# Vivado block design finn_design, xczu7ev-ffvc1156-2-e, Vivado 2022.2
create_bd_design finn_design

create_bd_intf_port -mode Slave -vlnv xilinx.com:interface:axis_rtl:1.0 s_axis_0
set_property -dict [list \
  CONFIG.HAS_TKEEP 0 \
  CONFIG.HAS_TLAST 0 \
  CONFIG.HAS_TREADY 1 \
  CONFIG.HAS_TSTRB 0 \
  CONFIG.LAYERED_METADATA undef \
  CONFIG.TDATA_NUM_BYTES 3 \
  CONFIG.TDEST_WIDTH 0 \
  CONFIG.TID_WIDTH 0 \
  CONFIG.TUSER_WIDTH 0 \
] [get_bd_intf_ports s_axis_0]
create_bd_intf_port -mode Master -vlnv xilinx.com:interface:axis_rtl:1.0 m_axis_0
create_bd_port -dir I -type clk ap_clk
set_property -dict {CONFIG.FREQ_HZ 100000000} [get_bd_ports ap_clk]
create_bd_port -dir I -type rst ap_rst_n

create_bd_cell -type module -reference StreamingFIFO_rtl_0 StreamingFIFO_rtl_0
create_bd_cell -type module -reference FMPadding_rtl_0 FMPadding_rtl_0
create_bd_cell -type module -reference StreamingFIFO_rtl_1 StreamingFIFO_rtl_1
create_bd_cell -type module -reference StreamingDataWidthConverter_rtl_0 StreamingDataWidthConverter_rtl_0
create_bd_cell -type module -reference StreamingFIFO_rtl_2 StreamingFIFO_rtl_2
create_bd_cell -type module -reference ConvolutionInputGenerator_rtl_0 ConvolutionInputGenerator_rtl_0
create_bd_cell -type module -reference StreamingFIFO_rtl_3 StreamingFIFO_rtl_3
create_bd_cell -type module -reference StreamingDataWidthConverter_rtl_1 StreamingDataWidthConverter_rtl_1
create_bd_cell -type module -reference StreamingFIFO_rtl_4 StreamingFIFO_rtl_4
create_bd_cell -type hier MVAU_hls_0
create_bd_cell -type module -reference StreamingFIFO_rtl_5 StreamingFIFO_rtl_5
create_bd_cell -type ip -vlnv xilinx.com:hls:DuplicateStreams_hls_0:1.0 DuplicateStreams_hls_0
create_bd_cell -type module -reference StreamingFIFO_rtl_6 StreamingFIFO_rtl_6
create_bd_cell -type hier StreamingFIFO_rtl_7_0
create_bd_cell -type hier StreamingFIFO_rtl_7_1
create_bd_cell -type module -reference StreamingDataWidthConverter_rtl_2 StreamingDataWidthConverter_rtl_2
create_bd_cell -type module -reference StreamingFIFO_rtl_7_2 StreamingFIFO_rtl_7_2
create_bd_cell -type module -reference StreamingFIFO_rtl_8 StreamingFIFO_rtl_8
create_bd_cell -type module -reference StreamingFIFO_rtl_7_3 StreamingFIFO_rtl_7_3
create_bd_cell -type module -reference FMPadding_rtl_1 FMPadding_rtl_1
create_bd_cell -type module -reference Thresholding_rtl_0_axi_wrapper Thresholding_rtl_0
create_bd_cell -type module -reference StreamingFIFO_rtl_10 StreamingFIFO_rtl_10
create_bd_cell -type hier StreamingFIFO_rtl_9_0
create_bd_cell -type module -reference StreamingDataWidthConverter_rtl_3 StreamingDataWidthConverter_rtl_3
create_bd_cell -type hier StreamingFIFO_rtl_9_1
create_bd_cell -type module -reference StreamingFIFO_rtl_11 StreamingFIFO_rtl_11
create_bd_cell -type hier StreamingFIFO_rtl_9_2
create_bd_cell -type module -reference ConvolutionInputGenerator_rtl_1 ConvolutionInputGenerator_rtl_1
create_bd_cell -type module -reference StreamingFIFO_rtl_9_3 StreamingFIFO_rtl_9_3
create_bd_cell -type module -reference StreamingFIFO_rtl_12 StreamingFIFO_rtl_12
create_bd_cell -type module -reference StreamingFIFO_rtl_9_4 StreamingFIFO_rtl_9_4
create_bd_cell -type module -reference StreamingDataWidthConverter_rtl_4 StreamingDataWidthConverter_rtl_4
create_bd_cell -type module -reference StreamingFIFO_rtl_13 StreamingFIFO_rtl_13
create_bd_cell -type hier MVAU_hls_1
create_bd_cell -type module -reference StreamingFIFO_rtl_14 StreamingFIFO_rtl_14
create_bd_cell -type module -reference StreamingDataWidthConverter_rtl_5 StreamingDataWidthConverter_rtl_5
create_bd_cell -type module -reference StreamingFIFO_rtl_15 StreamingFIFO_rtl_15
create_bd_cell -type module -reference FMPadding_rtl_2 FMPadding_rtl_2
create_bd_cell -type module -reference StreamingFIFO_rtl_16 StreamingFIFO_rtl_16
create_bd_cell -type module -reference StreamingDataWidthConverter_rtl_6 StreamingDataWidthConverter_rtl_6
create_bd_cell -type module -reference StreamingFIFO_rtl_17 StreamingFIFO_rtl_17
create_bd_cell -type module -reference ConvolutionInputGenerator_rtl_2 ConvolutionInputGenerator_rtl_2
create_bd_cell -type module -reference StreamingFIFO_rtl_18 StreamingFIFO_rtl_18
create_bd_cell -type module -reference StreamingDataWidthConverter_rtl_7 StreamingDataWidthConverter_rtl_7
create_bd_cell -type module -reference StreamingFIFO_rtl_19 StreamingFIFO_rtl_19
create_bd_cell -type hier MVAU_hls_2
create_bd_cell -type module -reference StreamingFIFO_rtl_20 StreamingFIFO_rtl_20
create_bd_cell -type module -reference Thresholding_rtl_1_axi_wrapper Thresholding_rtl_1
create_bd_cell -type module -reference StreamingFIFO_rtl_21 StreamingFIFO_rtl_21
create_bd_cell -type ip -vlnv xilinx.com:hls:AddStreams_hls_0:1.0 AddStreams_hls_0
create_bd_cell -type module -reference StreamingFIFO_rtl_22 StreamingFIFO_rtl_22
create_bd_cell -type ip -vlnv xilinx.com:hls:DuplicateStreams_hls_1:1.0 DuplicateStreams_hls_1
create_bd_cell -type module -reference StreamingFIFO_rtl_23 StreamingFIFO_rtl_23
create_bd_cell -type hier StreamingFIFO_rtl_24_0
create_bd_cell -type hier StreamingFIFO_rtl_24_1
create_bd_cell -type module -reference StreamingDataWidthConverter_rtl_8 StreamingDataWidthConverter_rtl_8
create_bd_cell -type module -reference StreamingFIFO_rtl_24_2 StreamingFIFO_rtl_24_2
create_bd_cell -type module -reference StreamingFIFO_rtl_25 StreamingFIFO_rtl_25
create_bd_cell -type module -reference StreamingFIFO_rtl_24_3 StreamingFIFO_rtl_24_3
create_bd_cell -type module -reference FMPadding_rtl_3 FMPadding_rtl_3
create_bd_cell -type module -reference Thresholding_rtl_2_axi_wrapper Thresholding_rtl_2
create_bd_cell -type module -reference StreamingFIFO_rtl_27 StreamingFIFO_rtl_27
create_bd_cell -type hier StreamingFIFO_rtl_26_0
create_bd_cell -type module -reference StreamingDataWidthConverter_rtl_9 StreamingDataWidthConverter_rtl_9
create_bd_cell -type hier StreamingFIFO_rtl_26_1
create_bd_cell -type module -reference StreamingFIFO_rtl_28 StreamingFIFO_rtl_28
create_bd_cell -type hier StreamingFIFO_rtl_26_2
create_bd_cell -type module -reference ConvolutionInputGenerator_rtl_3 ConvolutionInputGenerator_rtl_3
create_bd_cell -type module -reference StreamingFIFO_rtl_26_3 StreamingFIFO_rtl_26_3
create_bd_cell -type module -reference StreamingFIFO_rtl_29 StreamingFIFO_rtl_29
create_bd_cell -type module -reference StreamingFIFO_rtl_26_4 StreamingFIFO_rtl_26_4
create_bd_cell -type module -reference StreamingDataWidthConverter_rtl_10 StreamingDataWidthConverter_rtl_10
create_bd_cell -type module -reference StreamingFIFO_rtl_30 StreamingFIFO_rtl_30
create_bd_cell -type hier MVAU_hls_3
create_bd_cell -type module -reference StreamingFIFO_rtl_31 StreamingFIFO_rtl_31
create_bd_cell -type module -reference StreamingDataWidthConverter_rtl_11 StreamingDataWidthConverter_rtl_11
create_bd_cell -type module -reference StreamingFIFO_rtl_32 StreamingFIFO_rtl_32
create_bd_cell -type module -reference FMPadding_rtl_4 FMPadding_rtl_4
create_bd_cell -type module -reference StreamingFIFO_rtl_33 StreamingFIFO_rtl_33
create_bd_cell -type module -reference StreamingDataWidthConverter_rtl_12 StreamingDataWidthConverter_rtl_12
create_bd_cell -type module -reference StreamingFIFO_rtl_34 StreamingFIFO_rtl_34
create_bd_cell -type module -reference ConvolutionInputGenerator_rtl_4 ConvolutionInputGenerator_rtl_4
create_bd_cell -type module -reference StreamingFIFO_rtl_35 StreamingFIFO_rtl_35
create_bd_cell -type module -reference StreamingDataWidthConverter_rtl_13 StreamingDataWidthConverter_rtl_13
create_bd_cell -type module -reference StreamingFIFO_rtl_36 StreamingFIFO_rtl_36
create_bd_cell -type hier MVAU_hls_4
create_bd_cell -type module -reference StreamingFIFO_rtl_37 StreamingFIFO_rtl_37
create_bd_cell -type module -reference Thresholding_rtl_3_axi_wrapper Thresholding_rtl_3
create_bd_cell -type module -reference StreamingFIFO_rtl_38 StreamingFIFO_rtl_38
create_bd_cell -type ip -vlnv xilinx.com:hls:AddStreams_hls_1:1.0 AddStreams_hls_1
create_bd_cell -type module -reference StreamingFIFO_rtl_39 StreamingFIFO_rtl_39
create_bd_cell -type ip -vlnv xilinx.com:hls:DuplicateStreams_hls_2:1.0 DuplicateStreams_hls_2
create_bd_cell -type module -reference StreamingFIFO_rtl_40 StreamingFIFO_rtl_40
create_bd_cell -type hier StreamingFIFO_rtl_41_0
create_bd_cell -type hier StreamingFIFO_rtl_41_1
create_bd_cell -type module -reference StreamingDataWidthConverter_rtl_14 StreamingDataWidthConverter_rtl_14
create_bd_cell -type hier StreamingFIFO_rtl_41_2
create_bd_cell -type module -reference StreamingFIFO_rtl_42 StreamingFIFO_rtl_42
create_bd_cell -type module -reference StreamingFIFO_rtl_41_3 StreamingFIFO_rtl_41_3
create_bd_cell -type module -reference FMPadding_rtl_5 FMPadding_rtl_5
create_bd_cell -type module -reference Thresholding_rtl_4_axi_wrapper Thresholding_rtl_4
create_bd_cell -type module -reference StreamingFIFO_rtl_44 StreamingFIFO_rtl_44
create_bd_cell -type hier StreamingFIFO_rtl_43_0
create_bd_cell -type module -reference StreamingDataWidthConverter_rtl_15 StreamingDataWidthConverter_rtl_15
create_bd_cell -type hier StreamingFIFO_rtl_43_1
create_bd_cell -type module -reference StreamingFIFO_rtl_45 StreamingFIFO_rtl_45
create_bd_cell -type hier StreamingFIFO_rtl_43_2
create_bd_cell -type module -reference ConvolutionInputGenerator_rtl_5 ConvolutionInputGenerator_rtl_5
create_bd_cell -type module -reference StreamingFIFO_rtl_43_3 StreamingFIFO_rtl_43_3
create_bd_cell -type module -reference StreamingFIFO_rtl_46 StreamingFIFO_rtl_46
create_bd_cell -type module -reference StreamingFIFO_rtl_43_4 StreamingFIFO_rtl_43_4
create_bd_cell -type module -reference StreamingDataWidthConverter_rtl_16 StreamingDataWidthConverter_rtl_16
create_bd_cell -type module -reference StreamingFIFO_rtl_47 StreamingFIFO_rtl_47
create_bd_cell -type hier MVAU_hls_5
create_bd_cell -type module -reference StreamingFIFO_rtl_48 StreamingFIFO_rtl_48
create_bd_cell -type module -reference StreamingDataWidthConverter_rtl_17 StreamingDataWidthConverter_rtl_17
create_bd_cell -type module -reference StreamingFIFO_rtl_49 StreamingFIFO_rtl_49
create_bd_cell -type module -reference FMPadding_rtl_6 FMPadding_rtl_6
create_bd_cell -type module -reference StreamingFIFO_rtl_50 StreamingFIFO_rtl_50
create_bd_cell -type module -reference StreamingDataWidthConverter_rtl_18 StreamingDataWidthConverter_rtl_18
create_bd_cell -type module -reference StreamingFIFO_rtl_51 StreamingFIFO_rtl_51
create_bd_cell -type module -reference ConvolutionInputGenerator_rtl_6 ConvolutionInputGenerator_rtl_6
create_bd_cell -type module -reference StreamingFIFO_rtl_52 StreamingFIFO_rtl_52
create_bd_cell -type module -reference StreamingDataWidthConverter_rtl_19 StreamingDataWidthConverter_rtl_19
create_bd_cell -type module -reference StreamingFIFO_rtl_53 StreamingFIFO_rtl_53
create_bd_cell -type hier MVAU_hls_6
create_bd_cell -type module -reference StreamingFIFO_rtl_54 StreamingFIFO_rtl_54
create_bd_cell -type module -reference Thresholding_rtl_5_axi_wrapper Thresholding_rtl_5
create_bd_cell -type module -reference StreamingFIFO_rtl_55 StreamingFIFO_rtl_55
create_bd_cell -type ip -vlnv xilinx.com:hls:AddStreams_hls_2:1.0 AddStreams_hls_2
create_bd_cell -type module -reference StreamingFIFO_rtl_56 StreamingFIFO_rtl_56
create_bd_cell -type ip -vlnv xilinx.com:hls:DuplicateStreams_hls_3:1.0 DuplicateStreams_hls_3
create_bd_cell -type module -reference StreamingFIFO_rtl_57 StreamingFIFO_rtl_57
create_bd_cell -type hier StreamingFIFO_rtl_58_0
create_bd_cell -type module -reference StreamingFIFO_rtl_58_1 StreamingFIFO_rtl_58_1
create_bd_cell -type module -reference StreamingDataWidthConverter_rtl_20 StreamingDataWidthConverter_rtl_20
create_bd_cell -type module -reference StreamingDataWidthConverter_rtl_21 StreamingDataWidthConverter_rtl_21
create_bd_cell -type module -reference StreamingFIFO_rtl_59 StreamingFIFO_rtl_59
create_bd_cell -type hier StreamingFIFO_rtl_60_0
create_bd_cell -type module -reference FMPadding_rtl_7 FMPadding_rtl_7
create_bd_cell -type module -reference StreamingFIFO_rtl_60_1 StreamingFIFO_rtl_60_1
create_bd_cell -type module -reference StreamingFIFO_rtl_62 StreamingFIFO_rtl_62
create_bd_cell -type hier MVAU_hls_7
create_bd_cell -type module -reference StreamingDataWidthConverter_rtl_22 StreamingDataWidthConverter_rtl_22
create_bd_cell -type hier StreamingFIFO_rtl_61_0
create_bd_cell -type module -reference StreamingFIFO_rtl_63 StreamingFIFO_rtl_63
create_bd_cell -type module -reference StreamingFIFO_rtl_61_1 StreamingFIFO_rtl_61_1
create_bd_cell -type module -reference ConvolutionInputGenerator_rtl_7 ConvolutionInputGenerator_rtl_7
create_bd_cell -type module -reference StreamingFIFO_rtl_64 StreamingFIFO_rtl_64
create_bd_cell -type module -reference StreamingDataWidthConverter_rtl_23 StreamingDataWidthConverter_rtl_23
create_bd_cell -type module -reference StreamingFIFO_rtl_65 StreamingFIFO_rtl_65
create_bd_cell -type hier MVAU_hls_8
create_bd_cell -type module -reference StreamingFIFO_rtl_66 StreamingFIFO_rtl_66
create_bd_cell -type module -reference StreamingDataWidthConverter_rtl_24 StreamingDataWidthConverter_rtl_24
create_bd_cell -type module -reference StreamingFIFO_rtl_67 StreamingFIFO_rtl_67
create_bd_cell -type module -reference FMPadding_rtl_8 FMPadding_rtl_8
create_bd_cell -type module -reference StreamingFIFO_rtl_68 StreamingFIFO_rtl_68
create_bd_cell -type module -reference StreamingDataWidthConverter_rtl_25 StreamingDataWidthConverter_rtl_25
create_bd_cell -type module -reference StreamingFIFO_rtl_69 StreamingFIFO_rtl_69
create_bd_cell -type module -reference ConvolutionInputGenerator_rtl_8 ConvolutionInputGenerator_rtl_8
create_bd_cell -type module -reference StreamingFIFO_rtl_70 StreamingFIFO_rtl_70
create_bd_cell -type module -reference StreamingDataWidthConverter_rtl_26 StreamingDataWidthConverter_rtl_26
create_bd_cell -type module -reference StreamingFIFO_rtl_71 StreamingFIFO_rtl_71
create_bd_cell -type hier MVAU_hls_9
create_bd_cell -type module -reference StreamingFIFO_rtl_72 StreamingFIFO_rtl_72
create_bd_cell -type module -reference StreamingDataWidthConverter_rtl_27 StreamingDataWidthConverter_rtl_27
create_bd_cell -type module -reference StreamingFIFO_rtl_73 StreamingFIFO_rtl_73
create_bd_cell -type module -reference Thresholding_rtl_6_axi_wrapper Thresholding_rtl_6
create_bd_cell -type module -reference StreamingFIFO_rtl_74 StreamingFIFO_rtl_74
create_bd_cell -type ip -vlnv xilinx.com:hls:AddStreams_hls_3:1.0 AddStreams_hls_3
create_bd_cell -type module -reference StreamingFIFO_rtl_75 StreamingFIFO_rtl_75
create_bd_cell -type ip -vlnv xilinx.com:hls:DuplicateStreams_hls_4:1.0 DuplicateStreams_hls_4
create_bd_cell -type module -reference StreamingFIFO_rtl_76 StreamingFIFO_rtl_76
create_bd_cell -type hier StreamingFIFO_rtl_77_0
create_bd_cell -type module -reference StreamingFIFO_rtl_77_1 StreamingFIFO_rtl_77_1
create_bd_cell -type module -reference StreamingDataWidthConverter_rtl_28 StreamingDataWidthConverter_rtl_28
create_bd_cell -type module -reference Thresholding_rtl_7_axi_wrapper Thresholding_rtl_7
create_bd_cell -type module -reference StreamingFIFO_rtl_78 StreamingFIFO_rtl_78
create_bd_cell -type hier StreamingFIFO_rtl_79_0
create_bd_cell -type module -reference FMPadding_rtl_9 FMPadding_rtl_9
create_bd_cell -type module -reference StreamingFIFO_rtl_79_1 StreamingFIFO_rtl_79_1
create_bd_cell -type module -reference StreamingFIFO_rtl_80 StreamingFIFO_rtl_80
create_bd_cell -type module -reference StreamingDataWidthConverter_rtl_29 StreamingDataWidthConverter_rtl_29
create_bd_cell -type module -reference StreamingFIFO_rtl_81 StreamingFIFO_rtl_81
create_bd_cell -type module -reference ConvolutionInputGenerator_rtl_9 ConvolutionInputGenerator_rtl_9
create_bd_cell -type module -reference StreamingFIFO_rtl_82 StreamingFIFO_rtl_82
create_bd_cell -type module -reference StreamingDataWidthConverter_rtl_30 StreamingDataWidthConverter_rtl_30
create_bd_cell -type module -reference StreamingFIFO_rtl_83 StreamingFIFO_rtl_83
create_bd_cell -type hier MVAU_hls_10
create_bd_cell -type module -reference StreamingFIFO_rtl_84 StreamingFIFO_rtl_84
create_bd_cell -type module -reference StreamingDataWidthConverter_rtl_31 StreamingDataWidthConverter_rtl_31
create_bd_cell -type module -reference StreamingFIFO_rtl_85 StreamingFIFO_rtl_85
create_bd_cell -type module -reference FMPadding_rtl_10 FMPadding_rtl_10
create_bd_cell -type module -reference StreamingFIFO_rtl_86 StreamingFIFO_rtl_86
create_bd_cell -type module -reference StreamingDataWidthConverter_rtl_32 StreamingDataWidthConverter_rtl_32
create_bd_cell -type module -reference StreamingFIFO_rtl_87 StreamingFIFO_rtl_87
create_bd_cell -type module -reference ConvolutionInputGenerator_rtl_10 ConvolutionInputGenerator_rtl_10
create_bd_cell -type module -reference StreamingFIFO_rtl_88 StreamingFIFO_rtl_88
create_bd_cell -type module -reference StreamingDataWidthConverter_rtl_33 StreamingDataWidthConverter_rtl_33
create_bd_cell -type module -reference StreamingFIFO_rtl_89 StreamingFIFO_rtl_89
create_bd_cell -type hier MVAU_hls_11
create_bd_cell -type module -reference StreamingFIFO_rtl_90 StreamingFIFO_rtl_90
create_bd_cell -type module -reference StreamingDataWidthConverter_rtl_34 StreamingDataWidthConverter_rtl_34
create_bd_cell -type module -reference StreamingFIFO_rtl_91 StreamingFIFO_rtl_91
create_bd_cell -type module -reference Thresholding_rtl_8_axi_wrapper Thresholding_rtl_8
create_bd_cell -type module -reference StreamingFIFO_rtl_92 StreamingFIFO_rtl_92
create_bd_cell -type ip -vlnv xilinx.com:hls:AddStreams_hls_4:1.0 AddStreams_hls_4
create_bd_cell -type module -reference StreamingFIFO_rtl_93 StreamingFIFO_rtl_93
create_bd_cell -type ip -vlnv xilinx.com:hls:DuplicateStreams_hls_5:1.0 DuplicateStreams_hls_5
create_bd_cell -type module -reference StreamingFIFO_rtl_94 StreamingFIFO_rtl_94
create_bd_cell -type hier StreamingFIFO_rtl_95_0
create_bd_cell -type module -reference StreamingFIFO_rtl_95_1 StreamingFIFO_rtl_95_1
create_bd_cell -type module -reference StreamingDataWidthConverter_rtl_35 StreamingDataWidthConverter_rtl_35
create_bd_cell -type module -reference Thresholding_rtl_9_axi_wrapper Thresholding_rtl_9
create_bd_cell -type module -reference StreamingFIFO_rtl_96 StreamingFIFO_rtl_96
create_bd_cell -type hier StreamingFIFO_rtl_97_0
create_bd_cell -type module -reference FMPadding_rtl_11 FMPadding_rtl_11
create_bd_cell -type module -reference StreamingFIFO_rtl_97_1 StreamingFIFO_rtl_97_1
create_bd_cell -type module -reference StreamingFIFO_rtl_98 StreamingFIFO_rtl_98
create_bd_cell -type module -reference StreamingDataWidthConverter_rtl_36 StreamingDataWidthConverter_rtl_36
create_bd_cell -type module -reference StreamingFIFO_rtl_99 StreamingFIFO_rtl_99
create_bd_cell -type module -reference ConvolutionInputGenerator_rtl_11 ConvolutionInputGenerator_rtl_11
create_bd_cell -type module -reference StreamingFIFO_rtl_100 StreamingFIFO_rtl_100
create_bd_cell -type module -reference StreamingDataWidthConverter_rtl_37 StreamingDataWidthConverter_rtl_37
create_bd_cell -type module -reference StreamingFIFO_rtl_101 StreamingFIFO_rtl_101
create_bd_cell -type hier MVAU_hls_12
create_bd_cell -type module -reference StreamingFIFO_rtl_102 StreamingFIFO_rtl_102
create_bd_cell -type module -reference StreamingDataWidthConverter_rtl_38 StreamingDataWidthConverter_rtl_38
create_bd_cell -type module -reference StreamingFIFO_rtl_103 StreamingFIFO_rtl_103
create_bd_cell -type module -reference FMPadding_rtl_12 FMPadding_rtl_12
create_bd_cell -type module -reference StreamingFIFO_rtl_104 StreamingFIFO_rtl_104
create_bd_cell -type module -reference StreamingDataWidthConverter_rtl_39 StreamingDataWidthConverter_rtl_39
create_bd_cell -type module -reference StreamingFIFO_rtl_105 StreamingFIFO_rtl_105
create_bd_cell -type module -reference ConvolutionInputGenerator_rtl_12 ConvolutionInputGenerator_rtl_12
create_bd_cell -type module -reference StreamingFIFO_rtl_106 StreamingFIFO_rtl_106
create_bd_cell -type module -reference StreamingDataWidthConverter_rtl_40 StreamingDataWidthConverter_rtl_40
create_bd_cell -type module -reference StreamingFIFO_rtl_107 StreamingFIFO_rtl_107
create_bd_cell -type hier MVAU_hls_13
create_bd_cell -type module -reference StreamingFIFO_rtl_108 StreamingFIFO_rtl_108
create_bd_cell -type module -reference StreamingDataWidthConverter_rtl_41 StreamingDataWidthConverter_rtl_41
create_bd_cell -type module -reference StreamingFIFO_rtl_109 StreamingFIFO_rtl_109
create_bd_cell -type module -reference Thresholding_rtl_10_axi_wrapper Thresholding_rtl_10
create_bd_cell -type module -reference StreamingFIFO_rtl_110 StreamingFIFO_rtl_110
create_bd_cell -type ip -vlnv xilinx.com:hls:AddStreams_hls_5:1.0 AddStreams_hls_5
create_bd_cell -type module -reference StreamingFIFO_rtl_111 StreamingFIFO_rtl_111
create_bd_cell -type ip -vlnv xilinx.com:hls:DuplicateStreams_hls_6:1.0 DuplicateStreams_hls_6
create_bd_cell -type module -reference StreamingFIFO_rtl_112 StreamingFIFO_rtl_112
create_bd_cell -type hier StreamingFIFO_rtl_113_0
create_bd_cell -type module -reference StreamingFIFO_rtl_113_1 StreamingFIFO_rtl_113_1
create_bd_cell -type module -reference ConvolutionInputGenerator_rtl_14 ConvolutionInputGenerator_rtl_14
create_bd_cell -type module -reference ConvolutionInputGenerator_rtl_13 ConvolutionInputGenerator_rtl_13
create_bd_cell -type module -reference StreamingFIFO_rtl_115 StreamingFIFO_rtl_115
create_bd_cell -type hier StreamingFIFO_rtl_114_0
create_bd_cell -type ip -vlnv xilinx.com:hls:Pool_hls_0:1.0 Pool_hls_0
create_bd_cell -type module -reference StreamingFIFO_rtl_114_1 StreamingFIFO_rtl_114_1
create_bd_cell -type module -reference StreamingFIFO_rtl_117 StreamingFIFO_rtl_117
create_bd_cell -type hier MVAU_hls_14
create_bd_cell -type module -reference StreamingDataWidthConverter_rtl_42 StreamingDataWidthConverter_rtl_42
create_bd_cell -type hier StreamingFIFO_rtl_116_0
create_bd_cell -type module -reference StreamingFIFO_rtl_118 StreamingFIFO_rtl_118
create_bd_cell -type module -reference StreamingFIFO_rtl_116_1 StreamingFIFO_rtl_116_1
create_bd_cell -type module -reference FMPadding_rtl_13 FMPadding_rtl_13
create_bd_cell -type module -reference StreamingFIFO_rtl_119 StreamingFIFO_rtl_119
create_bd_cell -type module -reference StreamingDataWidthConverter_rtl_43 StreamingDataWidthConverter_rtl_43
create_bd_cell -type module -reference StreamingFIFO_rtl_120 StreamingFIFO_rtl_120
create_bd_cell -type module -reference ConvolutionInputGenerator_rtl_15 ConvolutionInputGenerator_rtl_15
create_bd_cell -type module -reference StreamingFIFO_rtl_121 StreamingFIFO_rtl_121
create_bd_cell -type module -reference StreamingDataWidthConverter_rtl_44 StreamingDataWidthConverter_rtl_44
create_bd_cell -type module -reference StreamingFIFO_rtl_122 StreamingFIFO_rtl_122
create_bd_cell -type hier MVAU_hls_15
create_bd_cell -type module -reference StreamingFIFO_rtl_123 StreamingFIFO_rtl_123
create_bd_cell -type module -reference StreamingDataWidthConverter_rtl_45 StreamingDataWidthConverter_rtl_45
create_bd_cell -type module -reference StreamingFIFO_rtl_124 StreamingFIFO_rtl_124
create_bd_cell -type module -reference FMPadding_rtl_14 FMPadding_rtl_14
create_bd_cell -type module -reference StreamingFIFO_rtl_125 StreamingFIFO_rtl_125
create_bd_cell -type module -reference StreamingDataWidthConverter_rtl_46 StreamingDataWidthConverter_rtl_46
create_bd_cell -type module -reference StreamingFIFO_rtl_126 StreamingFIFO_rtl_126
create_bd_cell -type module -reference ConvolutionInputGenerator_rtl_16 ConvolutionInputGenerator_rtl_16
create_bd_cell -type module -reference StreamingFIFO_rtl_127 StreamingFIFO_rtl_127
create_bd_cell -type module -reference StreamingDataWidthConverter_rtl_47 StreamingDataWidthConverter_rtl_47
create_bd_cell -type module -reference StreamingFIFO_rtl_128 StreamingFIFO_rtl_128
create_bd_cell -type hier MVAU_hls_16
create_bd_cell -type module -reference StreamingFIFO_rtl_129 StreamingFIFO_rtl_129
create_bd_cell -type module -reference Thresholding_rtl_11_axi_wrapper Thresholding_rtl_11
create_bd_cell -type module -reference StreamingFIFO_rtl_130 StreamingFIFO_rtl_130
create_bd_cell -type ip -vlnv xilinx.com:hls:AddStreams_hls_6:1.0 AddStreams_hls_6
create_bd_cell -type module -reference StreamingFIFO_rtl_131 StreamingFIFO_rtl_131
create_bd_cell -type ip -vlnv xilinx.com:hls:DuplicateStreams_hls_7:1.0 DuplicateStreams_hls_7
create_bd_cell -type module -reference StreamingFIFO_rtl_132 StreamingFIFO_rtl_132
create_bd_cell -type hier StreamingFIFO_rtl_133_0
create_bd_cell -type hier StreamingFIFO_rtl_133_1
create_bd_cell -type module -reference StreamingDataWidthConverter_rtl_48 StreamingDataWidthConverter_rtl_48
create_bd_cell -type hier StreamingFIFO_rtl_133_2
create_bd_cell -type module -reference StreamingFIFO_rtl_134 StreamingFIFO_rtl_134
create_bd_cell -type module -reference StreamingFIFO_rtl_133_3 StreamingFIFO_rtl_133_3
create_bd_cell -type module -reference FMPadding_rtl_15 FMPadding_rtl_15
create_bd_cell -type module -reference Thresholding_rtl_12_axi_wrapper Thresholding_rtl_12
create_bd_cell -type module -reference StreamingFIFO_rtl_136 StreamingFIFO_rtl_136
create_bd_cell -type hier StreamingFIFO_rtl_135_0
create_bd_cell -type module -reference StreamingDataWidthConverter_rtl_49 StreamingDataWidthConverter_rtl_49
create_bd_cell -type hier StreamingFIFO_rtl_135_1
create_bd_cell -type module -reference StreamingFIFO_rtl_137 StreamingFIFO_rtl_137
create_bd_cell -type hier StreamingFIFO_rtl_135_2
create_bd_cell -type module -reference ConvolutionInputGenerator_rtl_17 ConvolutionInputGenerator_rtl_17
create_bd_cell -type module -reference StreamingFIFO_rtl_135_3 StreamingFIFO_rtl_135_3
create_bd_cell -type module -reference StreamingFIFO_rtl_138 StreamingFIFO_rtl_138
create_bd_cell -type module -reference StreamingFIFO_rtl_135_4 StreamingFIFO_rtl_135_4
create_bd_cell -type module -reference StreamingDataWidthConverter_rtl_50 StreamingDataWidthConverter_rtl_50
create_bd_cell -type module -reference StreamingFIFO_rtl_139 StreamingFIFO_rtl_139
create_bd_cell -type hier MVAU_hls_17
create_bd_cell -type module -reference StreamingFIFO_rtl_140 StreamingFIFO_rtl_140
create_bd_cell -type module -reference StreamingDataWidthConverter_rtl_51 StreamingDataWidthConverter_rtl_51
create_bd_cell -type module -reference StreamingFIFO_rtl_141 StreamingFIFO_rtl_141
create_bd_cell -type module -reference FMPadding_rtl_16 FMPadding_rtl_16
create_bd_cell -type module -reference StreamingFIFO_rtl_142 StreamingFIFO_rtl_142
create_bd_cell -type module -reference StreamingDataWidthConverter_rtl_52 StreamingDataWidthConverter_rtl_52
create_bd_cell -type module -reference StreamingFIFO_rtl_143 StreamingFIFO_rtl_143
create_bd_cell -type module -reference ConvolutionInputGenerator_rtl_18 ConvolutionInputGenerator_rtl_18
create_bd_cell -type module -reference StreamingFIFO_rtl_144 StreamingFIFO_rtl_144
create_bd_cell -type module -reference StreamingDataWidthConverter_rtl_53 StreamingDataWidthConverter_rtl_53
create_bd_cell -type module -reference StreamingFIFO_rtl_145 StreamingFIFO_rtl_145
create_bd_cell -type hier MVAU_hls_18
create_bd_cell -type module -reference StreamingFIFO_rtl_146 StreamingFIFO_rtl_146
create_bd_cell -type module -reference Thresholding_rtl_13_axi_wrapper Thresholding_rtl_13
create_bd_cell -type module -reference StreamingFIFO_rtl_147 StreamingFIFO_rtl_147
create_bd_cell -type ip -vlnv xilinx.com:hls:AddStreams_hls_7:1.0 AddStreams_hls_7
create_bd_cell -type module -reference StreamingFIFO_rtl_148 StreamingFIFO_rtl_148
create_bd_cell -type ip -vlnv xilinx.com:hls:DuplicateStreams_hls_8:1.0 DuplicateStreams_hls_8
create_bd_cell -type module -reference StreamingFIFO_rtl_149 StreamingFIFO_rtl_149
create_bd_cell -type hier StreamingFIFO_rtl_150_0
create_bd_cell -type hier StreamingFIFO_rtl_150_1
create_bd_cell -type module -reference StreamingDataWidthConverter_rtl_54 StreamingDataWidthConverter_rtl_54
create_bd_cell -type hier StreamingFIFO_rtl_150_2
create_bd_cell -type module -reference StreamingFIFO_rtl_151 StreamingFIFO_rtl_151
create_bd_cell -type module -reference StreamingFIFO_rtl_150_3 StreamingFIFO_rtl_150_3
create_bd_cell -type module -reference FMPadding_rtl_17 FMPadding_rtl_17
create_bd_cell -type module -reference Thresholding_rtl_14_axi_wrapper Thresholding_rtl_14
create_bd_cell -type module -reference StreamingFIFO_rtl_153 StreamingFIFO_rtl_153
create_bd_cell -type hier StreamingFIFO_rtl_152_0
create_bd_cell -type module -reference StreamingDataWidthConverter_rtl_55 StreamingDataWidthConverter_rtl_55
create_bd_cell -type hier StreamingFIFO_rtl_152_1
create_bd_cell -type module -reference StreamingFIFO_rtl_154 StreamingFIFO_rtl_154
create_bd_cell -type hier StreamingFIFO_rtl_152_2
create_bd_cell -type module -reference ConvolutionInputGenerator_rtl_19 ConvolutionInputGenerator_rtl_19
create_bd_cell -type module -reference StreamingFIFO_rtl_152_3 StreamingFIFO_rtl_152_3
create_bd_cell -type module -reference StreamingFIFO_rtl_155 StreamingFIFO_rtl_155
create_bd_cell -type module -reference StreamingFIFO_rtl_152_4 StreamingFIFO_rtl_152_4
create_bd_cell -type module -reference StreamingDataWidthConverter_rtl_56 StreamingDataWidthConverter_rtl_56
create_bd_cell -type module -reference StreamingFIFO_rtl_156 StreamingFIFO_rtl_156
create_bd_cell -type hier MVAU_hls_19
create_bd_cell -type module -reference StreamingFIFO_rtl_157 StreamingFIFO_rtl_157
create_bd_cell -type module -reference StreamingDataWidthConverter_rtl_57 StreamingDataWidthConverter_rtl_57
create_bd_cell -type module -reference StreamingFIFO_rtl_158 StreamingFIFO_rtl_158
create_bd_cell -type module -reference FMPadding_rtl_18 FMPadding_rtl_18
create_bd_cell -type module -reference StreamingFIFO_rtl_159 StreamingFIFO_rtl_159
create_bd_cell -type module -reference StreamingDataWidthConverter_rtl_58 StreamingDataWidthConverter_rtl_58
create_bd_cell -type module -reference StreamingFIFO_rtl_160 StreamingFIFO_rtl_160
create_bd_cell -type module -reference ConvolutionInputGenerator_rtl_20 ConvolutionInputGenerator_rtl_20
create_bd_cell -type module -reference StreamingFIFO_rtl_161 StreamingFIFO_rtl_161
create_bd_cell -type module -reference StreamingDataWidthConverter_rtl_59 StreamingDataWidthConverter_rtl_59
create_bd_cell -type module -reference StreamingFIFO_rtl_162 StreamingFIFO_rtl_162
create_bd_cell -type hier MVAU_hls_20
create_bd_cell -type module -reference StreamingFIFO_rtl_163 StreamingFIFO_rtl_163
create_bd_cell -type module -reference Thresholding_rtl_15_axi_wrapper Thresholding_rtl_15
create_bd_cell -type module -reference StreamingFIFO_rtl_164 StreamingFIFO_rtl_164
create_bd_cell -type ip -vlnv xilinx.com:hls:AddStreams_hls_8:1.0 AddStreams_hls_8
create_bd_cell -type module -reference StreamingFIFO_rtl_165 StreamingFIFO_rtl_165
create_bd_cell -type module -reference ConvolutionInputGenerator_rtl_21 ConvolutionInputGenerator_rtl_21
create_bd_cell -type module -reference StreamingFIFO_rtl_166 StreamingFIFO_rtl_166
create_bd_cell -type module -reference StreamingDataWidthConverter_rtl_60 StreamingDataWidthConverter_rtl_60
create_bd_cell -type module -reference StreamingFIFO_rtl_167 StreamingFIFO_rtl_167
create_bd_cell -type hier MVAU_hls_21
create_bd_cell -type module -reference StreamingFIFO_rtl_168 StreamingFIFO_rtl_168
create_bd_cell -type ip -vlnv xilinx.com:hls:DuplicateStreams_hls_9:1.0 DuplicateStreams_hls_9
create_bd_cell -type hier StreamingFIFO_rtl_169_0
create_bd_cell -type module -reference StreamingFIFO_rtl_170 StreamingFIFO_rtl_170
create_bd_cell -type module -reference StreamingFIFO_rtl_169_1 StreamingFIFO_rtl_169_1
create_bd_cell -type module -reference ConvolutionInputGenerator_rtl_22 ConvolutionInputGenerator_rtl_22
create_bd_cell -type module -reference ConvolutionInputGenerator_rtl_23 ConvolutionInputGenerator_rtl_23
create_bd_cell -type module -reference StreamingFIFO_rtl_171 StreamingFIFO_rtl_171
create_bd_cell -type hier StreamingFIFO_rtl_172_0
create_bd_cell -type ip -vlnv xilinx.com:hls:Pool_hls_1:1.0 Pool_hls_1
create_bd_cell -type module -reference StreamingFIFO_rtl_172_1 StreamingFIFO_rtl_172_1
create_bd_cell -type module -reference StreamingFIFO_rtl_173 StreamingFIFO_rtl_173
create_bd_cell -type hier MVAU_hls_22
create_bd_cell -type module -reference StreamingDataWidthConverter_rtl_61 StreamingDataWidthConverter_rtl_61
create_bd_cell -type hier StreamingFIFO_rtl_174_0
create_bd_cell -type module -reference StreamingFIFO_rtl_175 StreamingFIFO_rtl_175
create_bd_cell -type module -reference StreamingFIFO_rtl_174_1 StreamingFIFO_rtl_174_1
create_bd_cell -type module -reference FMPadding_rtl_19 FMPadding_rtl_19
create_bd_cell -type module -reference StreamingFIFO_rtl_176 StreamingFIFO_rtl_176
create_bd_cell -type module -reference StreamingDataWidthConverter_rtl_62 StreamingDataWidthConverter_rtl_62
create_bd_cell -type module -reference StreamingFIFO_rtl_177 StreamingFIFO_rtl_177
create_bd_cell -type module -reference ConvolutionInputGenerator_rtl_24 ConvolutionInputGenerator_rtl_24
create_bd_cell -type module -reference StreamingFIFO_rtl_178 StreamingFIFO_rtl_178
create_bd_cell -type module -reference StreamingDataWidthConverter_rtl_63 StreamingDataWidthConverter_rtl_63
create_bd_cell -type module -reference StreamingFIFO_rtl_179 StreamingFIFO_rtl_179
create_bd_cell -type hier MVAU_hls_23
create_bd_cell -type module -reference StreamingFIFO_rtl_180 StreamingFIFO_rtl_180
create_bd_cell -type module -reference StreamingDataWidthConverter_rtl_64 StreamingDataWidthConverter_rtl_64
create_bd_cell -type module -reference StreamingFIFO_rtl_181 StreamingFIFO_rtl_181
create_bd_cell -type module -reference FMPadding_rtl_20 FMPadding_rtl_20
create_bd_cell -type module -reference StreamingFIFO_rtl_182 StreamingFIFO_rtl_182
create_bd_cell -type module -reference StreamingDataWidthConverter_rtl_65 StreamingDataWidthConverter_rtl_65
create_bd_cell -type module -reference StreamingFIFO_rtl_183 StreamingFIFO_rtl_183
create_bd_cell -type module -reference ConvolutionInputGenerator_rtl_25 ConvolutionInputGenerator_rtl_25
create_bd_cell -type module -reference StreamingFIFO_rtl_184 StreamingFIFO_rtl_184
create_bd_cell -type module -reference StreamingDataWidthConverter_rtl_66 StreamingDataWidthConverter_rtl_66
create_bd_cell -type module -reference StreamingFIFO_rtl_185 StreamingFIFO_rtl_185
create_bd_cell -type hier MVAU_hls_24
create_bd_cell -type module -reference StreamingFIFO_rtl_186 StreamingFIFO_rtl_186
create_bd_cell -type module -reference Thresholding_rtl_16_axi_wrapper Thresholding_rtl_16
create_bd_cell -type module -reference StreamingFIFO_rtl_187 StreamingFIFO_rtl_187
create_bd_cell -type ip -vlnv xilinx.com:hls:AddStreams_hls_9:1.0 AddStreams_hls_9
create_bd_cell -type module -reference StreamingFIFO_rtl_188 StreamingFIFO_rtl_188
create_bd_cell -type ip -vlnv xilinx.com:hls:DuplicateStreams_hls_10:1.0 DuplicateStreams_hls_10
create_bd_cell -type module -reference StreamingFIFO_rtl_189 StreamingFIFO_rtl_189
create_bd_cell -type hier StreamingFIFO_rtl_190_0
create_bd_cell -type hier StreamingFIFO_rtl_190_1
create_bd_cell -type module -reference StreamingDataWidthConverter_rtl_67 StreamingDataWidthConverter_rtl_67
create_bd_cell -type module -reference StreamingFIFO_rtl_190_2 StreamingFIFO_rtl_190_2
create_bd_cell -type module -reference StreamingFIFO_rtl_191 StreamingFIFO_rtl_191
create_bd_cell -type module -reference StreamingFIFO_rtl_190_3 StreamingFIFO_rtl_190_3
create_bd_cell -type module -reference FMPadding_rtl_21 FMPadding_rtl_21
create_bd_cell -type module -reference Thresholding_rtl_17_axi_wrapper Thresholding_rtl_17
create_bd_cell -type module -reference StreamingFIFO_rtl_193 StreamingFIFO_rtl_193
create_bd_cell -type hier StreamingFIFO_rtl_192_0
create_bd_cell -type module -reference StreamingDataWidthConverter_rtl_68 StreamingDataWidthConverter_rtl_68
create_bd_cell -type module -reference StreamingFIFO_rtl_192_1 StreamingFIFO_rtl_192_1
create_bd_cell -type module -reference StreamingFIFO_rtl_194 StreamingFIFO_rtl_194
create_bd_cell -type module -reference ConvolutionInputGenerator_rtl_26 ConvolutionInputGenerator_rtl_26
create_bd_cell -type module -reference StreamingFIFO_rtl_195 StreamingFIFO_rtl_195
create_bd_cell -type module -reference StreamingDataWidthConverter_rtl_69 StreamingDataWidthConverter_rtl_69
create_bd_cell -type module -reference StreamingFIFO_rtl_196 StreamingFIFO_rtl_196
create_bd_cell -type hier MVAU_hls_25
create_bd_cell -type module -reference StreamingFIFO_rtl_197 StreamingFIFO_rtl_197
create_bd_cell -type module -reference StreamingDataWidthConverter_rtl_70 StreamingDataWidthConverter_rtl_70
create_bd_cell -type module -reference StreamingFIFO_rtl_198 StreamingFIFO_rtl_198
create_bd_cell -type module -reference FMPadding_rtl_22 FMPadding_rtl_22
create_bd_cell -type module -reference StreamingFIFO_rtl_199 StreamingFIFO_rtl_199
create_bd_cell -type module -reference StreamingDataWidthConverter_rtl_71 StreamingDataWidthConverter_rtl_71
create_bd_cell -type module -reference StreamingFIFO_rtl_200 StreamingFIFO_rtl_200
create_bd_cell -type module -reference ConvolutionInputGenerator_rtl_27 ConvolutionInputGenerator_rtl_27
create_bd_cell -type module -reference StreamingFIFO_rtl_201 StreamingFIFO_rtl_201
create_bd_cell -type module -reference StreamingDataWidthConverter_rtl_72 StreamingDataWidthConverter_rtl_72
create_bd_cell -type module -reference StreamingFIFO_rtl_202 StreamingFIFO_rtl_202
create_bd_cell -type hier MVAU_hls_26
create_bd_cell -type module -reference StreamingFIFO_rtl_203 StreamingFIFO_rtl_203
create_bd_cell -type module -reference Thresholding_rtl_18_axi_wrapper Thresholding_rtl_18
create_bd_cell -type module -reference StreamingFIFO_rtl_204 StreamingFIFO_rtl_204
create_bd_cell -type ip -vlnv xilinx.com:hls:AddStreams_hls_10:1.0 AddStreams_hls_10
create_bd_cell -type module -reference StreamingFIFO_rtl_205 StreamingFIFO_rtl_205
create_bd_cell -type module -reference Thresholding_rtl_19_axi_wrapper Thresholding_rtl_19
create_bd_cell -type module -reference StreamingFIFO_rtl_206 StreamingFIFO_rtl_206
create_bd_cell -type module -reference StreamingDataWidthConverter_rtl_73 StreamingDataWidthConverter_rtl_73
create_bd_cell -type module -reference StreamingFIFO_rtl_207 StreamingFIFO_rtl_207
create_bd_cell -type module -reference FMPadding_rtl_23 FMPadding_rtl_23
create_bd_cell -type module -reference StreamingFIFO_rtl_208 StreamingFIFO_rtl_208
create_bd_cell -type module -reference StreamingDataWidthConverter_rtl_74 StreamingDataWidthConverter_rtl_74
create_bd_cell -type module -reference StreamingFIFO_rtl_209 StreamingFIFO_rtl_209
create_bd_cell -type module -reference ConvolutionInputGenerator_rtl_28 ConvolutionInputGenerator_rtl_28
create_bd_cell -type module -reference StreamingFIFO_rtl_210 StreamingFIFO_rtl_210
create_bd_cell -type hier MVAU_hls_27
create_bd_cell -type module -reference StreamingFIFO_rtl_211 StreamingFIFO_rtl_211
create_bd_cell -type ip -vlnv xilinx.com:hls:DuplicateStreams_hls_11:1.0 DuplicateStreams_hls_11
create_bd_cell -type module -reference StreamingFIFO_rtl_212 StreamingFIFO_rtl_212
create_bd_cell -type module -reference StreamingFIFO_rtl_213 StreamingFIFO_rtl_213
create_bd_cell -type module -reference ConvolutionInputGenerator_rtl_29 ConvolutionInputGenerator_rtl_29
create_bd_cell -type module -reference ConvolutionInputGenerator_rtl_30 ConvolutionInputGenerator_rtl_30
create_bd_cell -type module -reference StreamingFIFO_rtl_214 StreamingFIFO_rtl_214
create_bd_cell -type module -reference StreamingFIFO_rtl_215 StreamingFIFO_rtl_215
create_bd_cell -type ip -vlnv xilinx.com:hls:Pool_hls_2:1.0 Pool_hls_2
create_bd_cell -type hier MVAU_hls_28
create_bd_cell -type module -reference StreamingFIFO_rtl_216 StreamingFIFO_rtl_216
create_bd_cell -type module -reference StreamingFIFO_rtl_217 StreamingFIFO_rtl_217
create_bd_cell -type module -reference StreamingDataWidthConverter_rtl_75 StreamingDataWidthConverter_rtl_75
create_bd_cell -type module -reference StreamingFIFO_rtl_218 StreamingFIFO_rtl_218
create_bd_cell -type module -reference FMPadding_rtl_24 FMPadding_rtl_24
create_bd_cell -type module -reference StreamingFIFO_rtl_219 StreamingFIFO_rtl_219
create_bd_cell -type module -reference StreamingDataWidthConverter_rtl_76 StreamingDataWidthConverter_rtl_76
create_bd_cell -type module -reference StreamingFIFO_rtl_220 StreamingFIFO_rtl_220
create_bd_cell -type module -reference ConvolutionInputGenerator_rtl_31 ConvolutionInputGenerator_rtl_31
create_bd_cell -type module -reference StreamingFIFO_rtl_221 StreamingFIFO_rtl_221
create_bd_cell -type hier MVAU_hls_29
create_bd_cell -type module -reference StreamingFIFO_rtl_222 StreamingFIFO_rtl_222
create_bd_cell -type module -reference ConvolutionInputGenerator_rtl_32 ConvolutionInputGenerator_rtl_32
create_bd_cell -type module -reference StreamingFIFO_rtl_223 StreamingFIFO_rtl_223
create_bd_cell -type ip -vlnv xilinx.com:hls:Pool_hls_3:1.0 Pool_hls_3
create_bd_cell -type module -reference StreamingFIFO_rtl_224 StreamingFIFO_rtl_224
create_bd_cell -type module -reference StreamingDataWidthConverter_rtl_77 StreamingDataWidthConverter_rtl_77
create_bd_cell -type module -reference StreamingFIFO_rtl_225 StreamingFIFO_rtl_225
create_bd_cell -type module -reference FMPadding_rtl_25 FMPadding_rtl_25
create_bd_cell -type module -reference StreamingFIFO_rtl_226 StreamingFIFO_rtl_226
create_bd_cell -type module -reference StreamingDataWidthConverter_rtl_78 StreamingDataWidthConverter_rtl_78
create_bd_cell -type module -reference StreamingFIFO_rtl_227 StreamingFIFO_rtl_227
create_bd_cell -type module -reference ConvolutionInputGenerator_rtl_33 ConvolutionInputGenerator_rtl_33
create_bd_cell -type module -reference StreamingFIFO_rtl_228 StreamingFIFO_rtl_228
create_bd_cell -type hier MVAU_hls_30
create_bd_cell -type module -reference StreamingFIFO_rtl_229 StreamingFIFO_rtl_229
create_bd_cell -type module -reference Thresholding_rtl_20_axi_wrapper Thresholding_rtl_20
create_bd_cell -type module -reference StreamingFIFO_rtl_230 StreamingFIFO_rtl_230
create_bd_cell -type ip -vlnv xilinx.com:hls:AddStreams_hls_11:1.0 AddStreams_hls_11
create_bd_cell -type module -reference StreamingFIFO_rtl_231 StreamingFIFO_rtl_231
create_bd_cell -type module -reference StreamingDataWidthConverter_rtl_79 StreamingDataWidthConverter_rtl_79
create_bd_cell -type module -reference StreamingFIFO_rtl_232 StreamingFIFO_rtl_232
create_bd_cell -type module -reference FMPadding_rtl_26 FMPadding_rtl_26
create_bd_cell -type module -reference StreamingFIFO_rtl_233 StreamingFIFO_rtl_233
create_bd_cell -type module -reference StreamingDataWidthConverter_rtl_80 StreamingDataWidthConverter_rtl_80
create_bd_cell -type module -reference StreamingFIFO_rtl_234 StreamingFIFO_rtl_234
create_bd_cell -type module -reference ConvolutionInputGenerator_rtl_34 ConvolutionInputGenerator_rtl_34
create_bd_cell -type module -reference StreamingFIFO_rtl_235 StreamingFIFO_rtl_235
create_bd_cell -type hier MVAU_hls_31
create_bd_cell -type module -reference StreamingFIFO_rtl_236 StreamingFIFO_rtl_236
